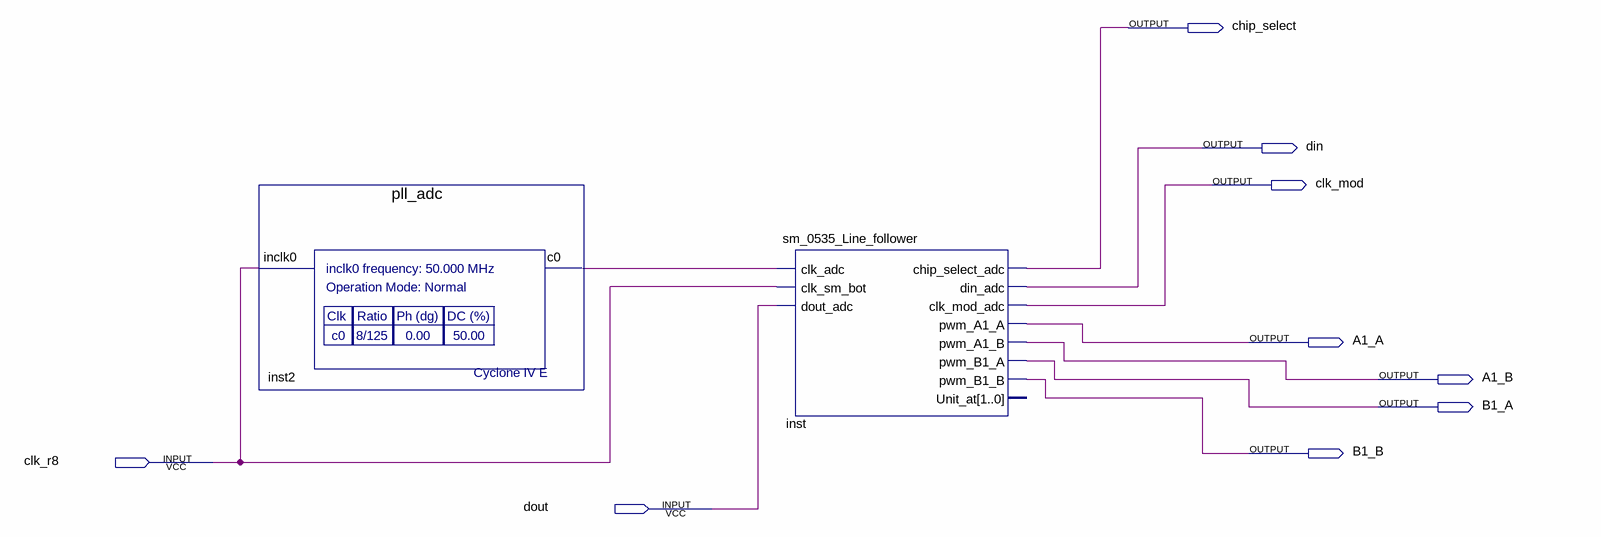
[diagram p0: schematic sheet]
// Quartus schematic line_follow_algo.bdf as structural Verilog: 2 symbols, 9 pins
module line_follow_algo (
  input  clk_r8,
  input  dout,
  output chip_select,
  output din,
  output clk_mod,
  output A1_A,
  output A1_B,
  output B1_A,
  output B1_B
);

  wire inst2_c0;

  pll_adc inst2 (.inclk0(clk_r8), .c0(inst2_c0));
  sm_0535_Line_follower inst (
    .clk_adc(inst2_c0), .clk_sm_bot(clk_r8), .dout_adc(dout), .chip_select_adc(chip_select), .din_adc(din),
    .clk_mod_adc(clk_mod), .pwm_A1_A(A1_A), .pwm_A1_B(A1_B), .pwm_B1_A(B1_A), .pwm_B1_B(B1_B));  // open: Unit_at
endmodule
